# EAGLE schematic Black-panda (EAGLE 9.6.2)
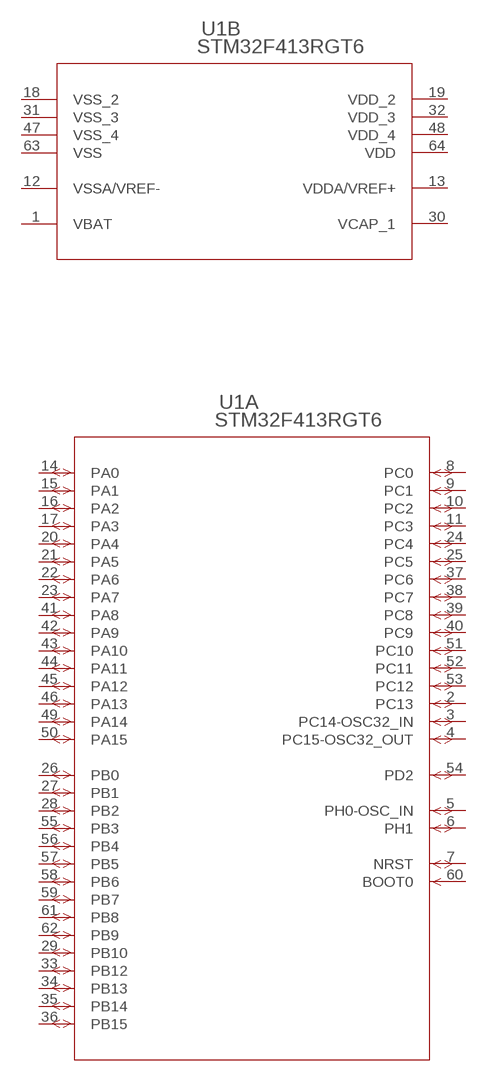
[diagram p0: schematic, sheet 1]

## Parts
U1  STM32F413RGT6  [LQFP64-10X10MM]
Unconnected: U1.2(A:PC13) U1.3(A:PC14-OSC32_IN) U1.4(A:PC15-OSC32_OUT) U1.5(A:PH0-OSC_IN) U1.6(A:PH1) U1.7(A:NRST) U1.8(A:PC0) U1.9(A:PC1) U1.10(A:PC2) U1.11(A:PC3) U1.14(A:PA0) U1.15(A:PA1) U1.16(A:PA2) U1.17(A:PA3) U1.20(A:PA4) U1.21(A:PA5) U1.22(A:PA6) U1.23(A:PA7) U1.24(A:PC4) U1.25(A:PC5) U1.26(A:PB0) U1.27(A:PB1) U1.28(A:PB2) U1.29(A:PB10) U1.33(A:PB12) U1.34(A:PB13) U1.35(A:PB14) U1.36(A:PB15) U1.37(A:PC6) U1.38(A:PC7) U1.39(A:PC8) U1.40(A:PC9) U1.41(A:PA8) U1.42(A:PA9) U1.43(A:PA10) U1.44(A:PA11) U1.45(A:PA12) U1.46(A:PA13) U1.49(A:PA14) U1.50(A:PA15) U1.51(A:PC10) U1.52(A:PC11) U1.53(A:PC12) U1.54(A:PD2) U1.55(A:PB3) U1.56(A:PB4) U1.57(A:PB5) U1.58(A:PB6) U1.59(A:PB7) U1.60(A:BOOT0) U1.61(A:PB8) U1.62(A:PB9)

## Power pins joined to a net without a drawn wire
VBAT: U1.1(B:VBAT)
VCAP_1: U1.30(B:VCAP_1)
VDD: U1.64(B:VDD)
VDD_2: U1.19(B:VDD_2)
VDD_3: U1.32(B:VDD_3)
VDD_4: U1.48(B:VDD_4)
VDDA/VREF+: U1.13(B:VDDA/VREF+)
VSS: U1.63(B:VSS)
VSS_2: U1.18(B:VSS_2)
VSS_3: U1.31(B:VSS_3)
VSS_4: U1.47(B:VSS_4)
VSSA/VREF-: U1.12(B:VSSA/VREF-)

## Library data of the parts
U1 = interceptor:STM32F413RGT6; BUILT_BY: EMA_UL_Team; COPYRIGHT: Copyright (C) 2018 Accelerated Designs. All rights reserved; MANUFACTURER_PART_NUMBER: STM32F413RGT6; SOURCELIBRARY: Updates_to_database_2020-10-19; VENDOR: STMicroelectronics